# Altium project roverDriveBrushless.PrjPcb
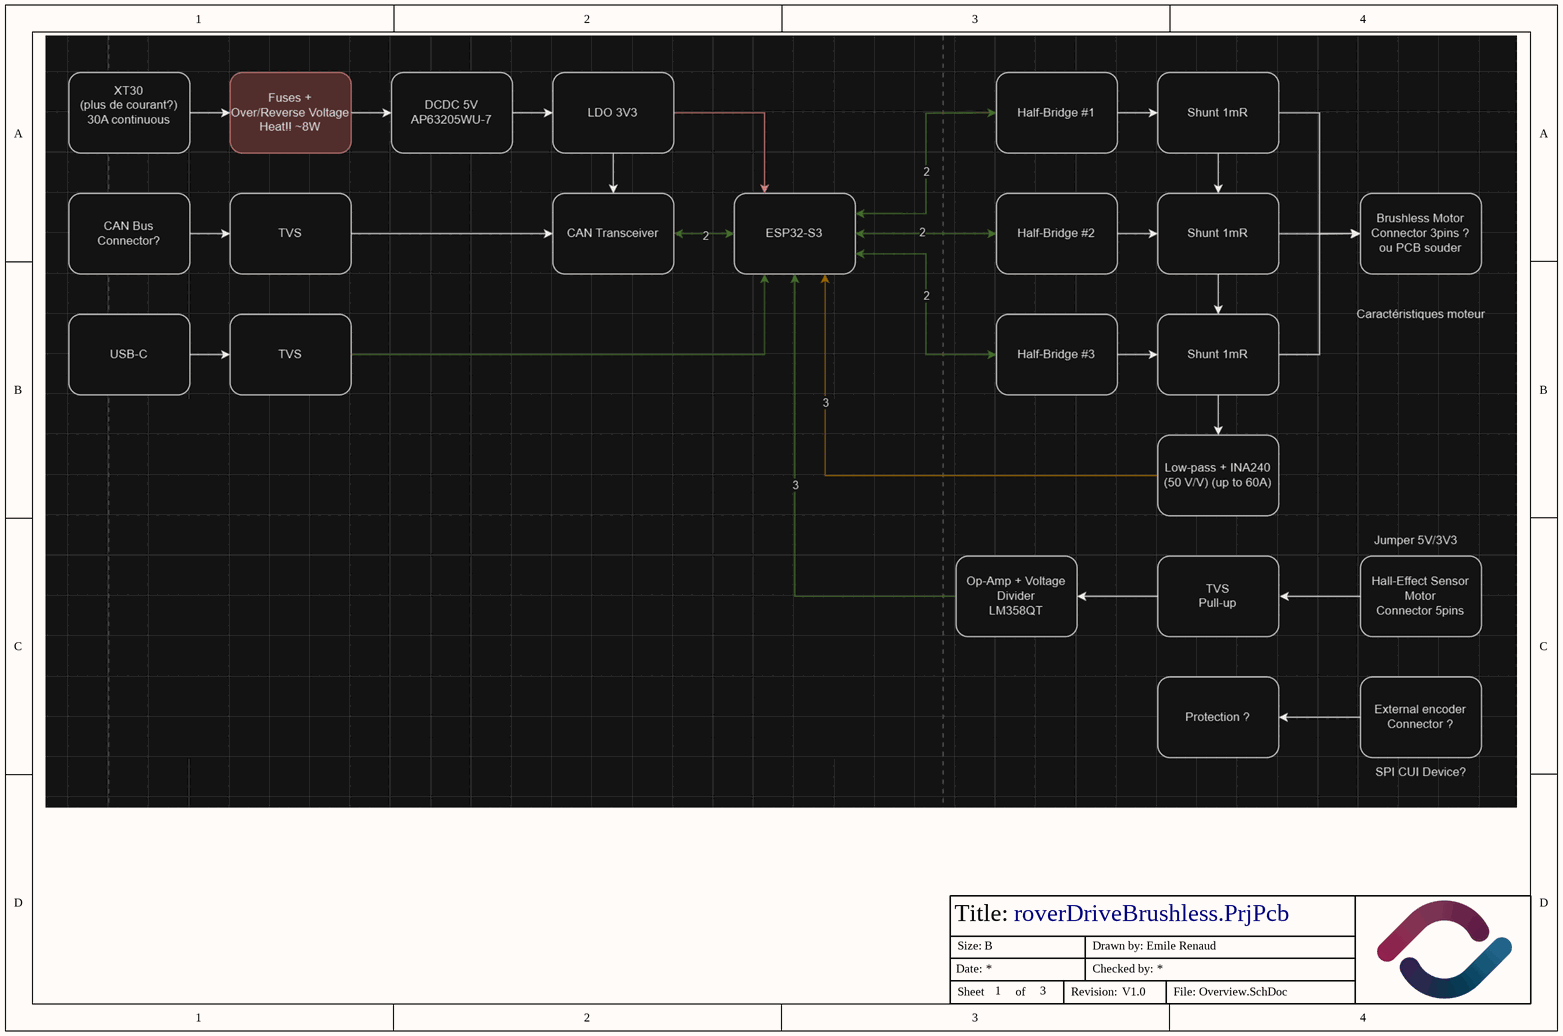
[diagram p0: Overview.SchDoc]
5 sheets, 128 parts. Net scope: global (net labels, ports and power ports of the same name join across sheets).
Board file: roverDriveBrushless.PcbDoc
Sheets:
  Overview.SchDoc
  ESP32.SchDoc
  Power.SchDoc
  MotorDriver.SchDoc
  Sensors.SchDoc

## Sheet Overview.SchDoc
size A4; DrawnBy: Emile Renaud; Revision: V1.0; SheetNumber: 1; SheetTotal: 3

### Notes on the sheet
- Title:
- Date:
- Size:
- B
- Drawn by:
- Checked by:
- Sheet
- of
- Revision:
- File:

## Sheet ESP32.SchDoc
size A4; DrawnBy: Emile Renaud; Revision: V1.0; SheetNumber: 2; SheetTotal: 5
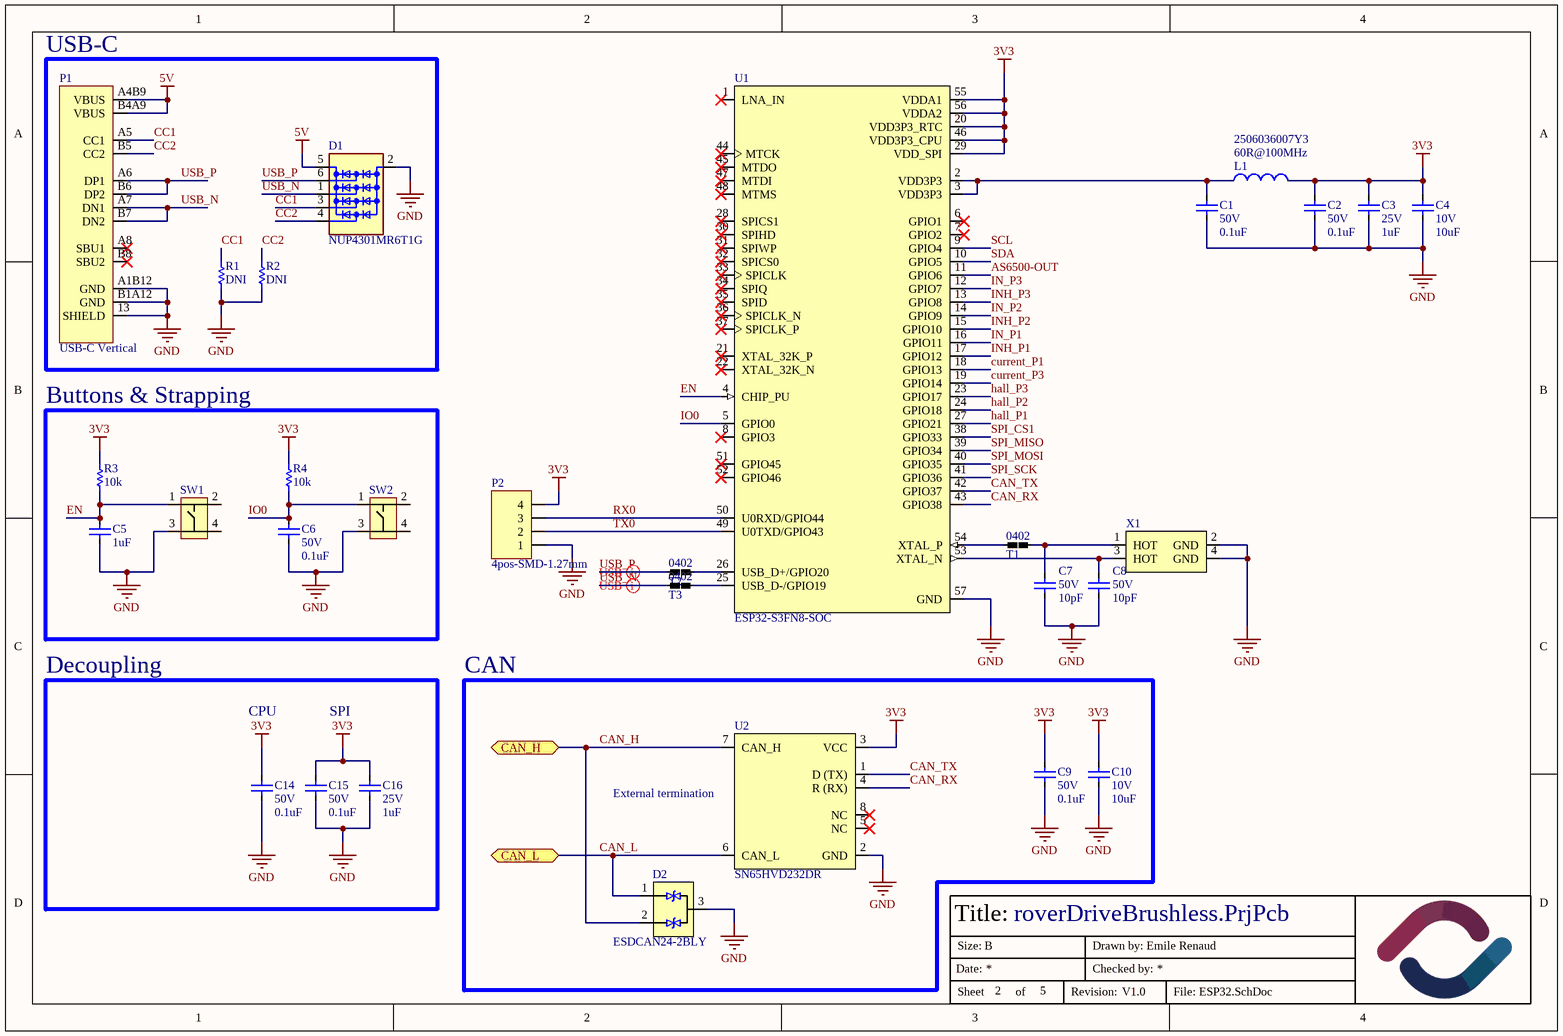
[diagram p1: ESP32.SchDoc]

### Parts
C1  value 0.1uF  Volt: 50V  [CAPACITOR-0603]  (hidden comment: Capacitor-0603-0.1uF-50V-X7R)
C2  value 0.1uF  Volt: 50V  [CAPACITOR-0603]  (hidden comment: Capacitor-0603-0.1uF-50V-X7R)
C3  value 1uF  Volt: 25V  [CAPACITOR-0603]  (hidden comment: Capacitor-0603-1uF-25V-X5R)
C4  value 10uF  Volt: 10V  [CAPACITOR-0603]  (hidden comment: Capacitor-0603-10uF-10V-X5R)
C5  value 1uF  [CAPACITOR-0603]  (hidden comment: Capacitor-0603-1uF-25V-X5R)
C6  value 0.1uF  Volt: 50V  [CAPACITOR-0603]  (hidden comment: Capacitor-0603-0.1uF-50V-X7R)
C7  value 10pF  Volt: 50V  [CAPACITOR-0402]  (hidden comment: Capacitor-0402-10pF-50V-C0G)
C8  value 10pF  Volt: 50V  [CAPACITOR-0402]  (hidden comment: Capacitor-0402-10pF-50V-C0G)
C9  value 0.1uF  Volt: 50V  [CAPACITOR-0603]  (hidden comment: Capacitor-0603-0.1uF-50V-X7R)
C10  value 10uF  Volt: 10V  [CAPACITOR-0603]  (hidden comment: Capacitor-0603-10uF-10V-X5R)
C14  value 0.1uF  Volt: 50V  [CAPACITOR-0603]  (hidden comment: Capacitor-0603-0.1uF-50V-X7R)
C15  value 0.1uF  Volt: 50V  [CAPACITOR-0603]  (hidden comment: Capacitor-0603-0.1uF-50V-X7R)
C16  value 1uF  Volt: 25V  [CAPACITOR-0603]  (hidden comment: Capacitor-0603-1uF-25V-X5R)
D1  NUP4301MR6T1G  [SOT-23-6]
D2  ESDCAN24-2BLY  [SOT-23-3]
L1  2506036007Y3  value 60R@100MHz  [CAPACITOR-0603]
P1  USB-C Vertical  [GCT_USB4145-03-0230-C_REVA2]
P2  4pos-SMD-1.27mm  [HDR1X4-SMD-50mils]
R1  value DNI  [RESISTOR-0603]  (hidden comment: Resistor-0603-5.1k)
R2  value DNI  [RESISTOR-0603]  (hidden comment: Resistor-0603-5.1k)
R3  value 10k  [Resistor-0603]  (hidden comment: SMT resistor)
R4  value 10k  [Resistor-0603]  (hidden comment: SMT resistor)
SW1  PTS815 SJM 250 SMTR LFS  [SW4_PTS815 SJM 250 SMTR LFS_CNK]  (value not drawn)
SW2  PTS815 SJM 250 SMTR LFS  [SW4_PTS815 SJM 250 SMTR LFS_CNK]  (value not drawn)
T1  NetTie_0402  [NetTie-0402]  (value not drawn)
T2  NetTie_0402  [NetTie-0402]  (value not drawn)
T3  NetTie_0402  [NetTie-0402]  (value not drawn)
U1  ESP32-S3FN8-SOC  [VFQFN-56 Exposed Pad]
U2  SN65HVD232DR  [SOIC-8]
X1  CX2016DB40000D0FLJCC  [4-SMD]  (value not drawn)

### Blocks framed on the sheet
USB-C: D1 P1 R1 R2
Buttons & Strapping: C5 C6 R3 R4 SW1 SW2
Decoupling: C14-C16
CAN: C9 C10 D2 U2

### Ports
CAN_H (bidir, see Power[1D]), CAN_L (bidir, see Power[1D])

### Nets
3V3: C2.2 C3.2 C4.2 C9.2 C10.2 C14.2 C15.2 C16.2 L1.2 P2.4 R3.2 R4.2 U1.20(VDD3P3_RTC) U1.29(VDD_SPI) U1.46(VDD3P3_CPU) U1.55(VDDA1) U1.56(VDDA2) U2.3(VCC)
5V: D1.5(VDD) P1.A4B9(VBUS) P1.B4A9(VBUS)
GND: C1.1 C2.1 C3.1 C4.1 C5.1 C6.1 C7.1 C8.1 C9.1 C10.1 C14.1 C15.1 C16.1 D1.2(GND) D2.3(L3) P1.13(SHIELD) P1.A1B12(GND) P1.B1A12(GND) P2.1 R1.1 R2.1 SW1.3 SW2.3 U1.57(GND) U2.2(GND) X1.2(GND) X1.4(GND)
AS6500-OUT: U1.11(GPIO6)
CAN_H: D2.2(GND) U2.7(CAN_H) ; port CAN_H
CAN_L: D2.1(L2) U2.6(CAN_L) ; port CAN_L
CAN_RX: U1.43(GPIO38) U2.4(R_(RX))
CAN_TX: U1.42(GPIO37) U2.1(D_(TX))
CC1: D1.3(L3) P1.A5(CC1) R1.2
CC2: D1.4(L4) P1.B5(CC2) R2.2
current_P1: U1.18(GPIO13)
current_P3: U1.19(GPIO14)
EN: C5.2 R3.1 SW1.1 U1.4(CHIP_PU)
hall_P1: U1.27(GPIO21)
hall_P2: U1.24(GPIO18)
hall_P3: U1.23(GPIO17)
IN_P1: U1.16(GPIO11)
IN_P2: U1.14(GPIO9)
IN_P3: U1.12(GPIO7)
INH_P1: U1.17(GPIO12)
INH_P2: U1.15(GPIO10)
INH_P3: U1.13(GPIO8)
IO0: C6.2 R4.1 SW2.1 U1.5(GPIO0)
RX0: P2.3 U1.50(U0RXD/GPIO44)
SCL: U1.9(GPIO4)
SDA: U1.10(GPIO5)
SPI_CS1: U1.38(GPIO33)
SPI_MISO: U1.39(GPIO34)
SPI_MOSI: U1.40(GPIO35)
SPI_SCK: U1.41(GPIO36)
TX0: P2.2 U1.49(U0TXD/GPIO43)
USB_N: D1.1(L2) P1.A7(DN1) P1.B7(DN2) T3.2
USB_P: D1.6(L1) P1.A6(DP1) P1.B6(DP2) T2.2
NetC1_2: C1.2 L1.1 U1.2(VDD3P3) U1.3(VDD3P3)
NetC7_2: C7.2 T1.1 X1.1(HOT)
NetC8_2: C8.2 U1.53(XTAL_N) X1.3(HOT)
NetT1_2: T1.2 U1.54(XTAL_P)
NetT2_1: T2.1 U1.26(USB_D+/GPIO20)
NetT3_1: T3.1 U1.25(USB_D-/GPIO19)

Not connected (* = marked no-connect by the designer): P1 A8(SBU1)* B8(SBU2)*; SW1 2 4; SW2 2 4; U1 1(LNA_IN)* 6(GPIO1)* 7(GPIO2)* 8(GPIO3)* 21(XTAL_32K_P)* 22(XTAL_32K_N)* 28(SPICS1)* 30(SPIHD)* 31(SPIWP)* 32(SPICS0)* 33(SPICLK)* 34(SPIQ)* 35(SPID)* 36(SPICLK_N)* 37(SPICLK_P)* 44(MTCK)* 45(MTDO)* 47(MTDI)* 48(MTMS)* 51(GPIO45)* 52(GPIO46)*; U2 5(NC)* 8(NC)*

### Layout directives
differential pair; differential pair class USB: USB_N, USB_P

### Notes on the sheet
- CPU
- SPI
- (near U2) External termination
- Title:
- Date:
- Size:
- B
- Drawn by:
- Checked by:
- Sheet
- of
- Revision:
- File:
- (in symbol NetTie_0402) 0402

### Library data of the parts
C1 C2 C6 C9 C14 C15 = Capacitor-0603-0.1uF-50V-X7R: Precision: X7R-10%; Package / Case: Metric 1608, EIA 0603; Mounted: Yes; Supplier 1: Digi-Key; Supplier Part Number 1: 1276-1935-2-ND; Supplier 2: Digi-Key; Supplier Part Number 2: 1276-1934-2-ND
C3 C16 = Capacitor-0603-1uF-25V-X5R: Precision: X5R-10%; Package / Case: Metric 1608, EIA 0603; Mounted: Yes; Supplier 1: Digi-Key; Supplier Part Number 1: 1276-1859-2-ND; Supplier 2: Digi-Key; Supplier Part Number 2: 1276-1942-2-ND
C4 C10 = Capacitor-0603-10uF-10V-X5R: 10 µF ±20% 10V Ceramic Capacitor X5R 0603 (1608 Metric); Supplier 1: Digikey; Supplier Part Number 1: 4713-GMC10X5R106M10NTCT-ND; Mounted: Yes; Package / Case: Metric 1608 , EIA 0603; Precision: 20%
C5 = Capacitor-0603-1uF-25V-X5R: Precision: X5R-10%; Volt: 25V; Package / Case: Metric 1608, EIA 0603; Mounted: Yes; Supplier 1: Digi-Key; Supplier Part Number 1: 1276-1859-2-ND; Supplier 2: Digi-Key; Supplier Part Number 2: 1276-1942-2-ND
C7 C8 = Capacitor-0402-10pF-50V-C0G: Precision: C0G - 10%; Package / Case: 0402 (1005 Metric); Mounted: Yes; Supplier 1: Digi-Key; Supplier Part Number 1: 399-C0402C100K5GAC7867CT-ND; Supplier 2: Digi-Key; HelpURL: https://connect.kemet.com:7667/gateway/IntelliData-ComponentDocumentation/1.0/download/datasheet/C0402C100K5GACTU
D1 = NUP4301MR6T1G: 4CH Clamp Ipp Tvs Diode Surface Mount SOT23-6 (SC74); Volt: 70; Supplier 1: Digi-Key; Supplier Part Number 1: NUP4301MR6T1GOSTR-ND; Mounted: Yes; Package / Case: SOT23-6
D2 = ESDCAN24-2BLY: 55V Clamp 6A (8/20µs) Ipp Tvs Diode Surface Mount SOT-23; Volt: 24; Supplier 1: Digi-Key; Supplier Part Number 1: 5272-ESDCAN24-2BLYCT-ND; Mounted: Yes; Package / Case: SOT-23-3
L1 = 2506036007Y3: 60 Ohms @ 100 MHz 1 Signal Line Ferrite Bead 0603 (1608 Metric) 3A 40mOhm; Supplier 1: Digi-Key; Mounted: Yes; Supplier Part Number 1: 1934-1396-1-ND; Package / Case: SMD; Current: 3A
P1 = USB-C Vertical: USB4145-03-0230-C / 5A USB USB 2.0 Receptacle; Supplier 1: Digikey; Supplier Part Number 1: 2073-USB4145-03-0230-CCT-ND; Mounted: Yes; Package / Case: SMD; Volt: N/A
P2 = 4pos-SMD-1.27mm: 4pos SMD 1.27mm; Supplier 1: Digi-Key; Supplier Part Number 1: N/A; Mounted: Yes; Package / Case: TH; Volt: N/A
R1 R2 = Resistor-0603-DNI: 0603 footprint DO NOT INSTALL; Mounted: Yes; Package/Case: Metric 1608 , EIA 0603
R3 R4 = Resistor0603-10k: Precision: 1%; Watt: 0.1W; Mounted: Yes; Package / Case: Metric 1608, EIA 0603; Supplier 2: Digi-Key; Supplier 4: Digi-Key; Supplier Part Number 2: RMCF0603FT10K0TR-ND; Supplier 1: Digi-Key; Supplier 3: Digi-Key; Supplier Part Number 1: 311-10.0KHRTR-ND
SW1 SW2 = PTS815 SJM 250 SMTR LFS: TACT 4.2 X 3.2, 2.5 MM H, 180GF,; Volt: 12V; Current: 0.05A; Supplier 1: Digi-Key; Supplier Part Number 1: CKN12215-1-ND; Mounted: Yes
U1 = ESP32-S3FN8-SOC: IC RF TxRx + MCU Bluetooth, WiFi 802.11b/g/n, Bluetooth v5.0 2.412GHz ~ 2.484GHz 56-VFQFN Exposed Pad; MF: Espressif Systems; Availability: In Stock; MP: ESP32-S3FN8; Package: 56-VFQFN Exposed Pad; DigiKey Link: https://www.digikey.ca/en/products/detail/espressif-systems/ESP32-S3FN8/15822446; HelpURL: https://www.espressif.com/sites/default/files/documentation/esp32-s3_datasheet_en.pdf; Supplier 1: Digikey; Supplier Part Number 1: 1965-ESP32-S3FN8-ND
U2 = SN65HVD232DR: 1/1 Transceiver Half CANbus 8-SOIC; Package / Case: 8-SOIC; Mounted: Yes; Supplier 1: Digikey; Supplier Part Number 1: 296-26344-1-ND; HelpURL: https://www.ti.com/lit/ds/symlink/sn65hvd230.pdf?HQS=dis-dk-null-digikeymode-dsf-pf-null-wwe&ts=1723930967656&ref_url=https%253A%252F%252Fwww.ti.com%252Fgeneral%252Fdocs%252Fsuppproductinfo.tsp%253FdistId%253D10%2526gotoUrl%253Dhttps%253A%252F%252Fwww.ti.com%252Flit%252Fgpn%252Fsn65hvd230
X1 = CX2016DB40000D0FLJCC: 40 MHz ±10ppm Crystal 8pF 50 Ohms 4-SMD, No Lead; Supplier 1: Digikey; Supplier Part Number 1: 478-CX2016DB40000D0FLJCCCT-ND; Parameter 1: *

## Sheet Power.SchDoc
size A4; DrawnBy: Emile Renaud; Revision: V1.0; SheetNumber: 3; SheetTotal: 5
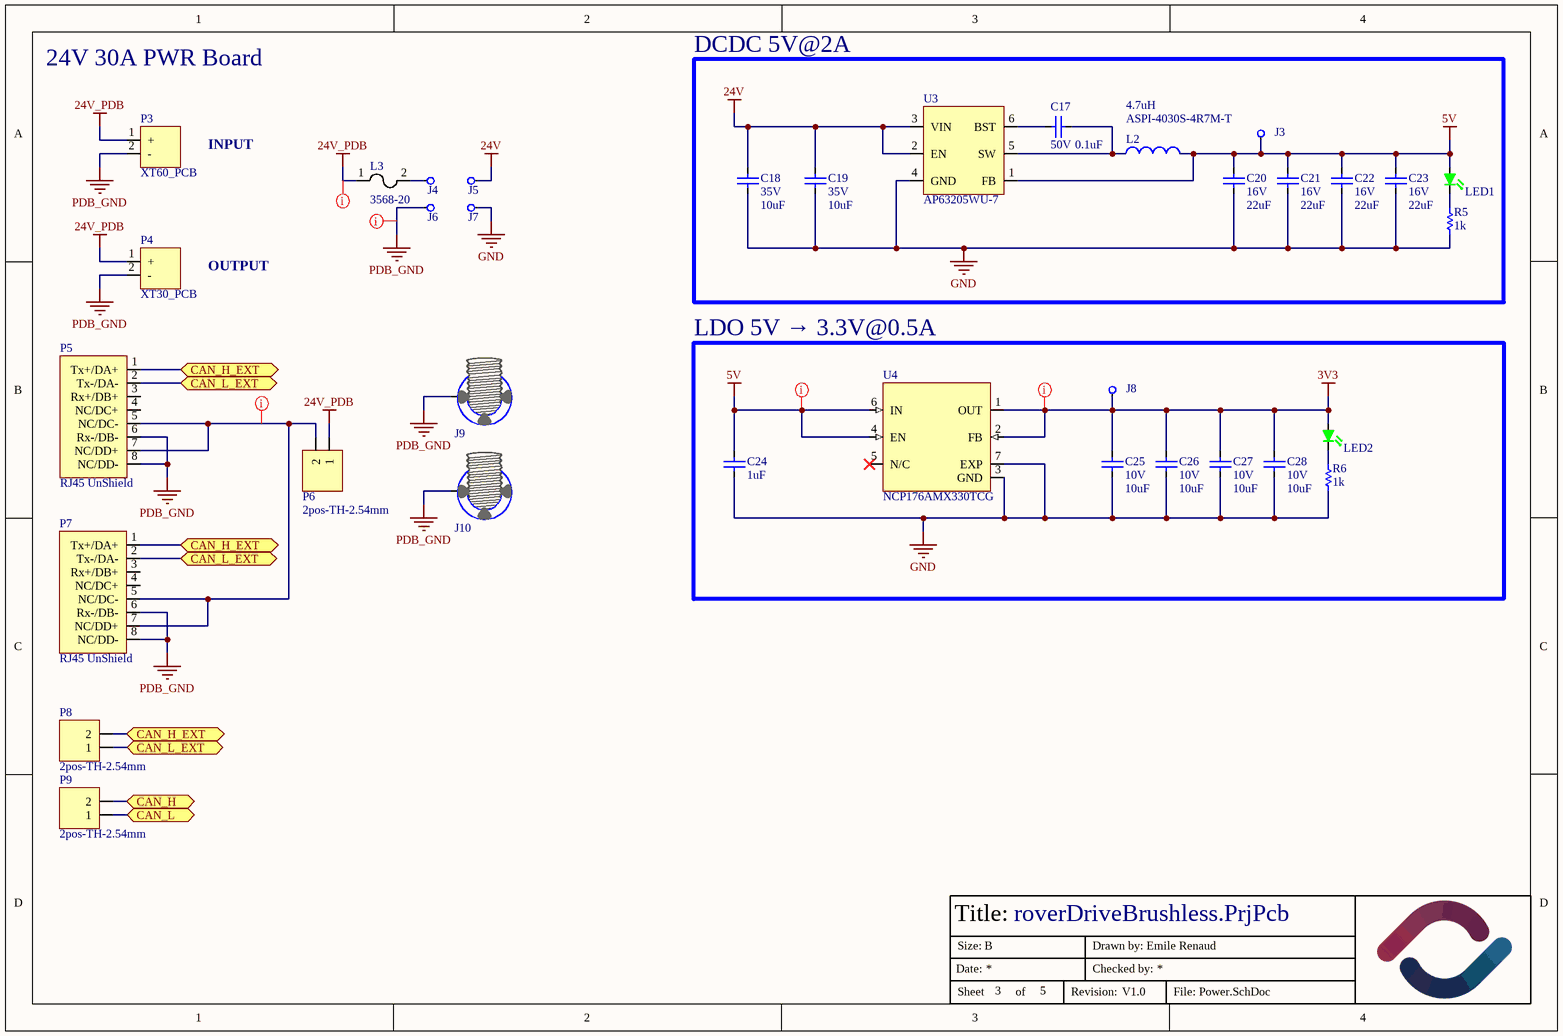
[diagram p2: Power.SchDoc]

### Parts
C17  value 0.1uF  Volt: 50V  [CAPACITOR-0603]  (hidden comment: Capacitor-0603-0.1uF-50V-X7R)
C18  value 10uF  Volt: 35V  [CAPACITOR-0805]  (hidden comment: Capacitor-0805-10uF-35V-X5R)
C19  value 10uF  Volt: 35V  [CAPACITOR-0805]  (hidden comment: Capacitor-0805-10uF-35V-X5R)
C20  value 22uF  Volt: 16V  [CAPACITOR-0805]  (hidden comment: Capacitor-0805-22uF-16V-X5R)
C21  value 22uF  Volt: 16V  [CAPACITOR-0805]  (hidden comment: Capacitor-0805-22uF-16V-X5R)
C22  value 22uF  Volt: 16V  [CAPACITOR-0805]  (hidden comment: Capacitor-0805-22uF-16V-X5R)
C23  value 22uF  Volt: 16V  [CAPACITOR-0805]  (hidden comment: Capacitor-0805-22uF-16V-X5R)
C24  value 1uF  [CAPACITOR-0603]  (hidden comment: Capacitor-0603-1uF-25V-X5R)
C25  value 10uF  Volt: 10V  [CAPACITOR-0603]  (hidden comment: Capacitor-0603-10uF-10V-X5R)
C26  value 10uF  Volt: 10V  [CAPACITOR-0603]  (hidden comment: Capacitor-0603-10uF-10V-X5R)
C27  value 10uF  Volt: 10V  [CAPACITOR-0603]  (hidden comment: Capacitor-0603-10uF-10V-X5R)
C28  value 10uF  Volt: 10V  [CAPACITOR-0603]  (hidden comment: Capacitor-0603-10uF-10V-X5R)
J3  hole  [PAD-1.2MM-silk]  (value not drawn)  (no BOM)
J4  hole  [HOLE-2.70MM]  (value not drawn)  (no BOM)
J5  hole  [HOLE-2.70MM]  (value not drawn)  (no BOM)
J6  hole  [HOLE-2.70MM]  (value not drawn)  (no BOM)
J7  hole  [HOLE-2.70MM]  (value not drawn)  (no BOM)
J8  hole  [PAD-1.2MM-silk]  (value not drawn)  (no BOM)
J9  hole  [HOLE-3.40MM-M3-7MMEYELET-MountingFeature]  (value not drawn)  (no BOM)
J10  hole  [HOLE-3.40MM-M3-7MMEYELET-MountingFeature]  (value not drawn)  (no BOM)
L2  ASPI-4030S-4R7M-T  value 4.7uH  [INDUCTOR_ASPI-4030S-100M]
L3  3568-20  [FUSE_3568-20]
LED1  3147-B1911NG--20D000214U1930CT-ND  [LED-0603-2PIN-SILKSCREEN]  (value not drawn)
LED2  3147-B1911NG--20D000214U1930CT-ND  [LED-0603-2PIN-SILKSCREEN]  (value not drawn)
P3  XT60_PCB  [XT60PW-M]
P4  XT30_PCB  [XT30PW_smd]
P5  RJ45 UnShield  [AMPHENOL_54602-908LF]
P6  2pos-TH-2.54mm  [HDR1X2]
P7  RJ45 UnShield  [AMPHENOL_54602-908LF]
P8  2pos-TH-2.54mm  [HDR1X2]
P9  2pos-TH-2.54mm  [HDR1X2]
R5  value 1k  [Resistor-0603]  (hidden comment: SMT resistor)
R6  value 1k  [Resistor-0603]  (hidden comment: SMT resistor)
U3  AP63205WU-7  [SOT-23-6]
U4  NCP176AMX330TCG  [XFDFN-6 Exposed Pad]

### Blocks framed on the sheet
DCDC 5V@2A: C17-C23 J3 L2 LED1 R5 U3
LDO 5V → 3.3V@0.5A: C24-C28 J8 LED2 R6 U4

### Ports
CAN_H (bidir, see ESP32[2C]), CAN_H_EXT (bidir, see Power[1B], Power[1C]), CAN_H_EXT (bidir, see Power[1C]), CAN_L (bidir, see ESP32[2D]), CAN_L_EXT (bidir, see Power[1B], Power[1C]), CAN_L_EXT (bidir, see Power[1C])

### Nets
3V3: C25.2 C26.2 C27.2 C28.2 J8.1 LED2.2(R) U4.1(OUT) U4.2(FB)
5V: C20.2 C21.2 C22.2 C23.2 C24.2 J3.1 L2.2 LED1.2(R) U3.1(FB) U4.4(EN) U4.6(IN)
24V: C18.2 C19.2 J5.1 U3.2(EN) U3.3(VIN)
24V_PDB: L3.1 P3.1(+) P4.1(+) P6.1
GND: C18.1 C19.1 C20.1 C21.1 C22.1 C23.1 C24.1 C25.1 C26.1 C27.1 C28.1 J7.1 R5.1 R6.1 U3.4(GND) U4.3(GND) U4.7(EXP)
PDB_GND: J6.1 J9.1 J10.1 P3.2(-) P4.2(-) P5.6(Rx-/DB-) P5.8(NC/DD-) P7.6(Rx-/DB-) P7.8(NC/DD-)
CAN_H: P9.2 ; port CAN_H
CAN_H_EXT: P5.1(Tx+/DA+) P7.1(Tx+/DA+) P8.2 ; port CAN_H_EXT
CAN_L: P9.1 ; port CAN_L
CAN_L_EXT: P5.2(Tx-/DA-) P7.2(Tx-/DA-) P8.1 ; port CAN_L_EXT
NetC17_1: C17.1 U3.6(BST)
NetC17_2: C17.2 L2.1 U3.5(SW)
NetJ4_1: J4.1 L3.2
NetLED1_1: LED1.1(K) R5.2
NetLED2_1: LED2.1(K) R6.2
NetP5_5: P5.5(NC/DC-) P5.7(NC/DD+) P6.2 P7.5(NC/DC-) P7.7(NC/DD+)

Not connected (* = marked no-connect by the designer): P5 3(Rx+/DB+) 4(NC/DC+); P7 3(Rx+/DB+) 4(NC/DC+); U4 5(N/C)*

### Layout directives
net class LOW_POWER: 3V3, 5V
net class Power: 24V_PDB, NetP5_5, PDB_GND

### Notes on the sheet
- 24V 30A PWR Board
- INPUT
- OUTPUT
- Title:
- Date:
- Size:
- B
- Drawn by:
- Checked by:
- Sheet
- of
- Revision:
- File:

### Library data of the parts
C17 = Capacitor-0603-0.1uF-50V-X7R: Precision: X7R-10%; Package / Case: Metric 1608, EIA 0603; Mounted: Yes; Supplier 1: Digi-Key; Supplier Part Number 1: 1276-1935-2-ND; Supplier 2: Digi-Key; Supplier Part Number 2: 1276-1934-2-ND
C18 C19 = Capacitor-0805-10uF-35V-X5R: Precision: X5R-10%; Package / Case: Metric 2012 , EIA 0805; Mounted: Yes; Supplier 1: Digi-Key; Supplier Part Number 1: 490-10515-1-ND; Supplier 2: Digi-Key
C20-C23 = Capacitor-0805-22uF-16V-X5R: Precision: X5R-10%; Package / Case: Metric 2012 , EIA 0805; Mounted: Yes; Supplier 1: Digi-Key; Supplier Part Number 1: 1276-6780-1-ND; Supplier 2: Digi-Key
C24 = Capacitor-0603-1uF-25V-X5R: Precision: X5R-10%; Volt: 25V; Package / Case: Metric 1608, EIA 0603; Mounted: Yes; Supplier 1: Digi-Key; Supplier Part Number 1: 1276-1859-2-ND; Supplier 2: Digi-Key; Supplier Part Number 2: 1276-1942-2-ND
C25-C28 = Capacitor-0603-10uF-10V-X5R: as C4 on sheet ESP32; Supplier 1: Digikey; Supplier Part Number 1: 4713-GMC10X5R106M10NTCT-ND; Mounted: Yes; Package / Case: Metric 1608 , EIA 0603; Precision: 20%
J3 J8 = PAD 1.2mm: Mounted: N/A
J4-J7 = Hole 2.70mm AWG12-Stranded: Hole for 12 AWG Stranded Wire; Mounted: N/A
J9 J10 = Hole 3.40mm M3-MountingFeature: Hole for M3 Bolt with 7mm pad; Mounted: N/A
L2 = ASPI-4030S-4R7M-T: 4.7 µH Shielded Drum Core, Wirewound Inductor 2 A 60mOhm Nonstandard; Current: 2A; Precision: 20%; Supplier 1: Digi-Key; Mounted: Yes; Supplier Part Number 1: 535-12322-1-ND; Package / Case: SMD; HelpURL: https://abracon.com/Magnetics/power/ASPI-4030S.pdf
L3 = 3568-20: Fuse Holder 30 A 500V 1 Circuit Blade Through Hole; Current: 30A; Supplier 1: Digi-Key; Mounted: Yes; Supplier Part Number 1: 36-3568-20-ND; Package / Case: TH
LED1 LED2 = LED_GREEN: LED GREEN DIFFUSED 0603 SMD; Package / Case: 0603 (1608 Metric); Mounted: Yes; Supplier 1: Digi-Key; Supplier Part Number 1: 3147-B1911NG--20D000214U1930CT-ND
P3 = XT60_pcb: XT60; Supplier 1: Digi-Key; Supplier Part Number 1: N/A277-1667-ND; Mounted: Yes; Package / Case: TH; Volt: N/A
P4 = XT30_pcb: XT30; Supplier 1: Digi-Key; Mounted: Yes; Package / Case: TH; Volt: N/A
P5 P7 = RJ545: Jack Modular Connector 8p8c (RJ45, Ethernet) 90° Angle (Right) Unshielded Cat3; Supplier 1: Digikey; Supplier Part Number 1: 609-1046-ND; Mounted: Yes; Package / Case: SMD; Volt: N/A; HelpURL: https://cdn.amphenol-cs.com/media/wysiwyg/files/drawing/c-bmj-0102.pdf
P6 P8 P9 = 2pos-TH-2.54mm: 2pos TH 2.54mm Header; Supplier 1: Digi-Key; Supplier Part Number 1: N/A; Mounted: Yes; Package / Case: TH; Volt: N/A
R5 R6 = Resistor0603-1k: Precision: 1%; Watt: 0.1W; Mounted: Yes; Package / Case: Metric 1608, EIA 0603; Supplier 2: Digi-Key; Supplier 4: Digi-Key; Supplier Part Number 2: 311-1.00KHRTR-ND; Supplier 1: Digi-Key; Supplier 3: Digi-Key; Supplier Part Number 1: RMCF0603FT1K00TR-ND; Supplier Part Number 3: AG1307TR-ND
U3 = AP63205WU-7: Fixed 5V@2A. 32V Input. SOT-23-6; Grade: None; Input Max Voltage: 36V; Supplier 1: Digi-Key; Supplier Part Number 1: AP63205WU-7DICT-ND; HelpURL: https://www.diodes.com/assets/Datasheets/AP63200-AP63201-AP63203-AP63205.pdf; Package / Case: SOT-23-6; Mounted: Yes
U4 = NCP176AMX330TCG: IC REG LINEAR 3.3V 500mA 6-XDFN; Supplier 1: Digi-Key; Supplier Part Number 1: NCP176AMX330TCGOSCT-ND; Package / Case: 6-XDFN; Mounted: Yes; HelpURL: https://www.onsemi.com/pdf/datasheet/ncp176-d.pdf

## Sheet MotorDriver.SchDoc
size A4; DrawnBy: Emile Renaud; Revision: V1.0; SheetNumber: 4; SheetTotal: 5
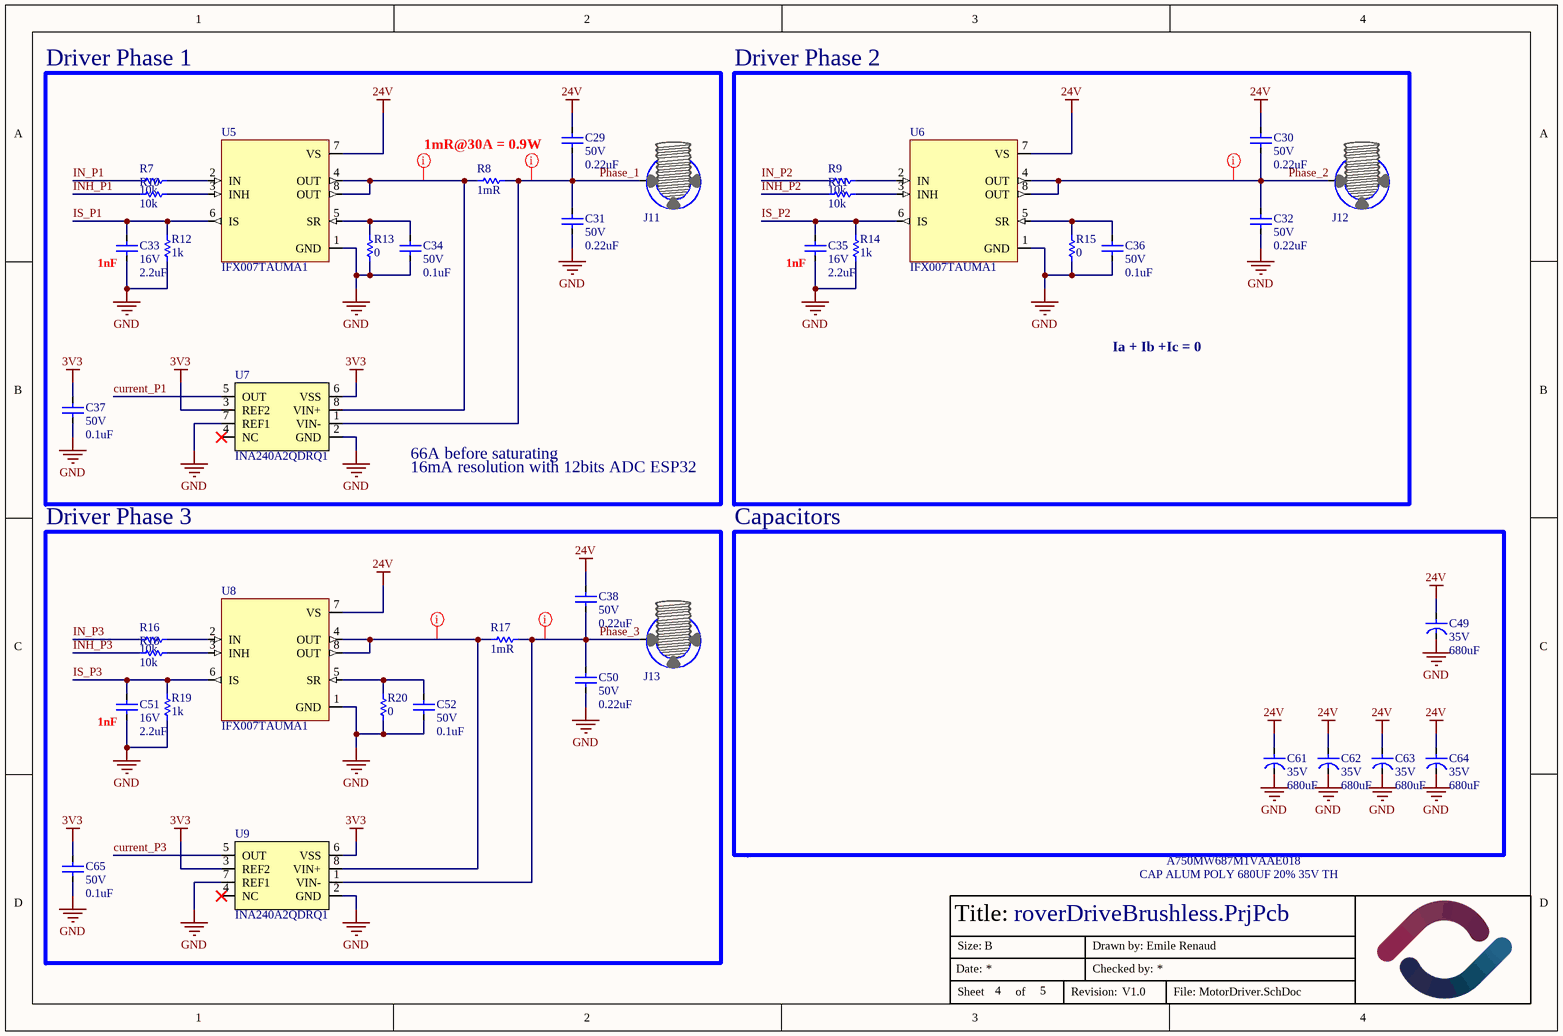
[diagram p3: MotorDriver.SchDoc]

### Parts
C29  value 0.22uF  Volt: 50V  [CAPACITOR-0603]  (hidden comment: Capacitor-0603-0.22uF-50V-X7R)
C30  value 0.22uF  Volt: 50V  [CAPACITOR-0603]  (hidden comment: Capacitor-0603-0.22uF-50V-X7R)
C31  value 0.22uF  Volt: 50V  [CAPACITOR-0603]  (hidden comment: Capacitor-0603-0.22uF-50V-X7R)
C32  value 0.22uF  Volt: 50V  [CAPACITOR-0603]  (hidden comment: Capacitor-0603-0.22uF-50V-X7R)
C33  value 2.2uF  Volt: 16V  [CAPACITOR-0603]  (hidden comment: Capacitor-0603-2.2uF-16V-X5R)
C34  value 0.1uF  Volt: 50V  [CAPACITOR-0603]  (hidden comment: Capacitor-0603-0.1uF-50V-X7R)
C35  value 2.2uF  Volt: 16V  [CAPACITOR-0603]  (hidden comment: Capacitor-0603-2.2uF-16V-X5R)
C36  value 0.1uF  Volt: 50V  [CAPACITOR-0603]  (hidden comment: Capacitor-0603-0.1uF-50V-X7R)
C37  value 0.1uF  Volt: 50V  [CAPACITOR-0603]  (hidden comment: Capacitor-0603-0.1uF-50V-X7R)
C38  value 0.22uF  Volt: 50V  [CAPACITOR-0603]  (hidden comment: Capacitor-0603-0.22uF-50V-X7R)
C49  value 680uF  Volt: 35V  [CAPACITOR-Aluminium-10.0x16mm-5mmPitch]  (hidden comment: CAP ALUM 680UF 20% 35V TH ESR 18mR)
C50  value 0.22uF  Volt: 50V  [CAPACITOR-0603]  (hidden comment: Capacitor-0603-0.22uF-50V-X7R)
C51  value 2.2uF  Volt: 16V  [CAPACITOR-0603]  (hidden comment: Capacitor-0603-2.2uF-16V-X5R)
C52  value 0.1uF  Volt: 50V  [CAPACITOR-0603]  (hidden comment: Capacitor-0603-0.1uF-50V-X7R)
C61  value 680uF  Volt: 35V  [CAPACITOR-Aluminium-10.0x16mm-5mmPitch]  (hidden comment: CAP ALUM 680UF 20% 35V TH ESR 18mR)
C62  value 680uF  Volt: 35V  [CAPACITOR-Aluminium-10.0x16mm-5mmPitch]  (hidden comment: CAP ALUM 680UF 20% 35V TH ESR 18mR)
C63  value 680uF  Volt: 35V  [CAPACITOR-Aluminium-10.0x16mm-5mmPitch]  (hidden comment: CAP ALUM 680UF 20% 35V TH ESR 18mR)
C64  value 680uF  Volt: 35V  [CAPACITOR-Aluminium-10.0x16mm-5mmPitch]  (hidden comment: CAP ALUM 680UF 20% 35V TH ESR 18mR)
C65  value 0.1uF  Volt: 50V  [CAPACITOR-0603]  (hidden comment: Capacitor-0603-0.1uF-50V-X7R)
J11  hole  [HOLE-M2-Bolt]  (value not drawn)  (no BOM)
J12  hole  [HOLE-M2-Bolt]  (value not drawn)  (no BOM)
J13  hole  [HOLE-M2-Bolt]  (value not drawn)  (no BOM)
R7  value 10k  [Resistor-0603]  (hidden comment: SMT resistor)
R8  value 1mR  [RESISTOR-3920]  (hidden comment: SMT resistor)
R9  value 10k  [Resistor-0603]  (hidden comment: SMT resistor)
R10  value 10k  [Resistor-0603]  (hidden comment: SMT resistor)
R11  value 10k  [Resistor-0603]  (hidden comment: SMT resistor)
R12  value 1k  [Resistor-0603]  (hidden comment: SMT resistor)
R13  value 0  [Resistor-0603]  (hidden comment: SMT resistor)
R14  value 1k  [Resistor-0603]  (hidden comment: SMT resistor)
R15  value 0  [Resistor-0603]  (hidden comment: SMT resistor)
R16  value 10k  [Resistor-0603]  (hidden comment: SMT resistor)
R17  value 1mR  [RESISTOR-3920]  (hidden comment: SMT resistor)
R18  value 10k  [Resistor-0603]  (hidden comment: SMT resistor)
R19  value 1k  [Resistor-0603]  (hidden comment: SMT resistor)
R20  value 0  [Resistor-0603]  (hidden comment: SMT resistor)
U5  IFX007TAUMA1  [DPAK127P1500X440-8N]
U6  IFX007TAUMA1  [DPAK127P1500X440-8N]
U7  INA240A2QDRQ1  [SOIC-8]
U8  IFX007TAUMA1  [DPAK127P1500X440-8N]
U9  INA240A2QDRQ1  [SOIC-8]

### Blocks framed on the sheet
Driver Phase 1: C29 C31 C33 C34 C37 J11 R7 R8 R10 R12 R13 U5 U7
Driver Phase 2: C30 C32 C35 C36 J12 R9 R11 R14 R15 U6
Driver Phase 3: C38 C50-C52 C65 J13 R16-R20 U8 U9
Capacitors: C49 C61-C64

### Nets
3V3: C37.2 C65.2 U7.3(REF2) U7.6(VSS) U9.3(REF2) U9.6(VSS)
24V: C29.2 C30.2 C38.2 C49.1 C61.1 C62.1 C63.1 C64.1 U5.7(VS) U6.7(VS) U8.7(VS)
GND: C31.1 C32.1 C33.1 C34.1 C35.1 C36.1 C37.1 C49.2 C50.1 C51.1 C52.1 C61.2 C62.2 C63.2 C64.2 C65.1 R12.1 R13.1 R14.1 R15.1 R19.1 R20.1 U5.1(GND) U6.1(GND) U7.2(GND) U7.7(REF1) U8.1(GND) U9.2(GND) U9.7(REF1)
current_P1: U7.5(OUT)
current_P3: U9.5(OUT)
IN_P1: R7.1
IN_P2: R9.1
IN_P3: R16.1
INH_P1: R10.1
INH_P2: R11.1
INH_P3: R18.1
IS_P1: C33.2 R12.2 U5.6(IS)
IS_P2: C35.2 R14.2 U6.6(IS)
IS_P3: C51.2 R19.2 U8.6(IS)
Phase_1: C29.1 C31.2 J11.1 R8.2 U7.1(VIN-)
Phase_2: C30.1 C32.2 J12.1 U6.4(OUT) U6.8(OUT)
Phase_3: C38.1 C50.2 J13.1 R17.2 U9.1(VIN-)
NetC34_2: C34.2 R13.2 U5.5(SR)
NetC36_2: C36.2 R15.2 U6.5(SR)
NetC52_2: C52.2 R20.2 U8.5(SR)
NetR7_2: R7.2 U5.2(IN)
NetR8_1: R8.1 U5.4(OUT) U5.8(OUT) U7.8(VIN+)
NetR9_2: R9.2 U6.2(IN)
NetR10_2: R10.2 U5.3(INH)
NetR11_2: R11.2 U6.3(INH)
NetR16_2: R16.2 U8.2(IN)
NetR17_1: R17.1 U8.4(OUT) U8.8(OUT) U9.8(VIN+)
NetR18_2: R18.2 U8.3(INH)

Not connected (* = marked no-connect by the designer): U7 4(NC)*; U9 4(NC)*

### Layout directives
net class Power: NetR8_1, NetR17_1, Phase_1, Phase_2, Phase_3

### Notes on the sheet
- (near R8) 1mR@30A = 0.9W
- (near C33) 1nF
- (near C35) 1nF
- Ia + Ib +Ic = 0
- 66A before saturating
- 16mA resolution with 12bits ADC ESP32
- (near C51) 1nF
- CAP ALUM POLY 680UF 20% 35V TH
- A750MW687M1VAAE018
- Title:
- Date:
- Size:
- B
- Drawn by:
- Checked by:
- Sheet
- of
- Revision:
- File:

### Library data of the parts
C29-C32 C38 C50 = Capacitor-0603-0.22uF-50V-X7R: Precision: X7R-10%; Package / Case: Metric 1608, EIA 0603; Mounted: Yes; Supplier 1: Digi-Key; Supplier Part Number 1: 1276-6600-1-ND; Supplier 2: Digi-Key
C33 C35 C51 = Capacitor-0603-2.2uF-16V-X5R: 2.2 µF ±10% 16V Ceramic Capacitor X5R 0603 (1608 Metric); Precision: X5R-10%; Mounted: Yes; Package / Case: Metric 1608 , EIA 0603; Supplier 1: Digikey; Supplier Part Number 1: 1276-1040-1-ND
C34 C36 C37 C52 C65 = Capacitor-0603-0.1uF-50V-X7R: Precision: X7R-10%; Package / Case: Metric 1608, EIA 0603; Mounted: Yes; Supplier 1: Digi-Key; Supplier Part Number 1: 1276-1935-2-ND; Supplier 2: Digi-Key; Supplier Part Number 2: 1276-1934-2-ND
C49 C61-C64 = Capacitor-680uF-35V-TH: Precision: 20%; Mounted: Yes; Supplier 1: Digi-Key; Supplier Part Number 1: 399-A750MW687M1VAAE018-ND; Supplier 2: Digi-Key; ESR: 18mR
J11-J13 = Hole 2.3mm M2: Hole for M2 Bolt with 4mm pad; Mounted: N/A
R7 R9-R11 R16 R18 = Resistor-0603-10k: Resistor0603-10k; Precision: 1%; Watt: 0.1W; Mounted: Yes; Package / Case: Metric 1608, EIA 0603; Supplier 1: Digi-Key; Supplier Part Number 1: 311-10.0KHRTR-ND
R8 R17 = Resistor-3920-1mR: Precision: 1%; Watt: 8W; Mounted: Yes; Package / Case: 3920; Supplier 1: Digi-Key; Supplier Part Number 1: 4506-PEWM3920D1L00K9CT-ND
R12 R14 R19 = Resistor-0603-1k: Resistor0603-1k; Precision: 1%; Watt: 0.1W; Mounted: Yes; Package / Case: Metric 1608, EIA 0603; Supplier 1: Digi-Key; Supplier Part Number 1: 311-1.00KHRCT-ND
R13 R15 R20 = Resistor-0603-0.0: Resistor0603-0.0; Precision: 1%; Watt: 0.1W; Mounted: Yes; Package / Case: Metric 1608, EIA 0603; Supplier 1: Digi-Key; Supplier Part Number 1: 311-0.0GRCT-ND
U5 U6 U8 = IFX007TAUMA1: Half Bridge Driver DC Motors, General Purpose Power MOSFET PG-TO263-7-1 55A 40V; Supplier 1: Digi-Key; Supplier Part Number 1: IFX007TAUMA1CT-ND; Package / Case: TO-263-8; Mounted: Yes
U7 U9 = INA240: Current Sense Amplifier 1 Circuit 8-SOIC 50 V/V; Supplier 1: Digi-Key; Supplier Part Number 1: 296-49647-1-ND; Package / Case: 8-SOIC; Mounted: Yes; helpURL: https://www.ti.com/general/docs/suppproductinfo.tsp?distId=10&gotoUrl=https%3A%2F%2Fwww.ti.com%2Flit%2Fgpn%2Fina240

## Sheet Sensors.SchDoc
size A4; DrawnBy: Emile Renaud; Revision: V1.0; SheetNumber: 5; SheetTotal: 5
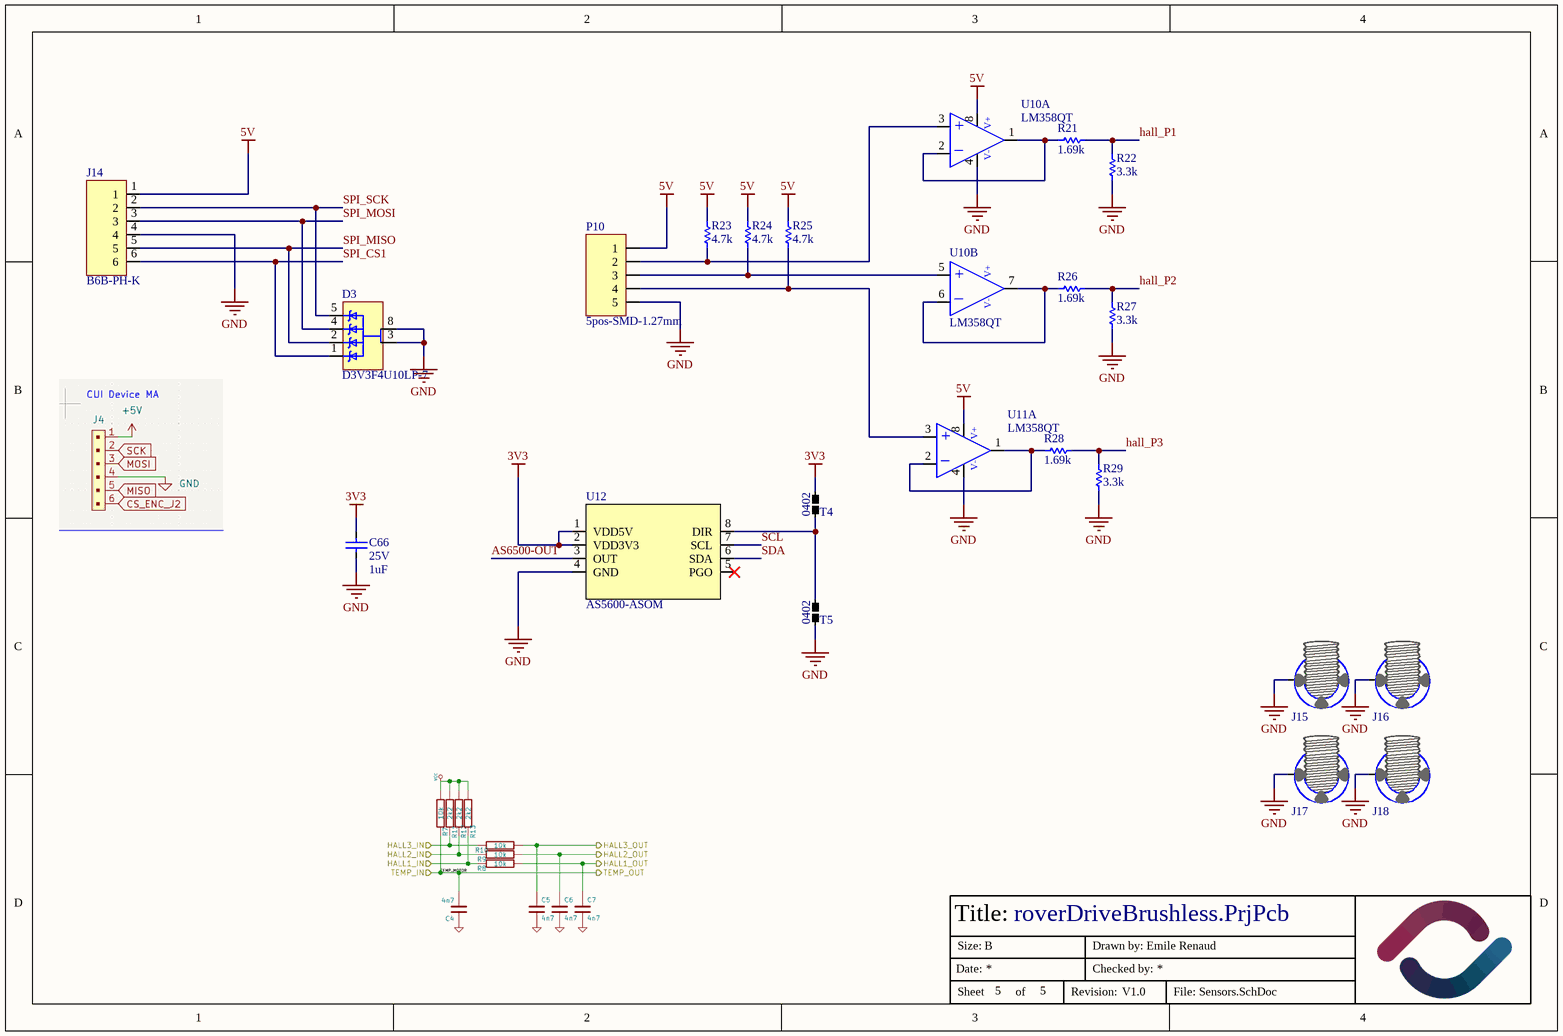
[diagram p4: Sensors.SchDoc]

### Parts
C66  value 1uF  Volt: 25V  [CAPACITOR-0603]  (hidden comment: Capacitor-0603-1uF-25V-X5R)
D3  D3V3F4U10LP-7  [U-DFN2510-10]
J14  B6B-PH-K  [B6B-PH-K]
J15  hole  [HOLE-3.40MM-M3-7MMEYELET-MountingFeature]  (value not drawn)  (no BOM)
J16  hole  [HOLE-3.40MM-M3-7MMEYELET-MountingFeature]  (value not drawn)  (no BOM)
J17  hole  [HOLE-3.40MM-M3-7MMEYELET-MountingFeature]  (value not drawn)  (no BOM)
J18  hole  [HOLE-3.40MM-M3-7MMEYELET-MountingFeature]  (value not drawn)  (no BOM)
P10  5pos-SMD-1.27mm  [HDR1X5-SMD-50mils-SILK]
R21  value 1.69k  [Resistor-0603]  (hidden comment: SMT resistor)
R22  value 3.3k  [Resistor-0603]  (hidden comment: SMT resistor)
R23  value 4.7k  [Resistor-0603]  (hidden comment: SMT resistor)
R24  value 4.7k  [Resistor-0603]  (hidden comment: SMT resistor)
R25  value 4.7k  [Resistor-0603]  (hidden comment: SMT resistor)
R26  value 1.69k  [Resistor-0603]  (hidden comment: SMT resistor)
R27  value 3.3k  [Resistor-0603]  (hidden comment: SMT resistor)
R28  value 1.69k  [Resistor-0603]  (hidden comment: SMT resistor)
R29  value 3.3k  [Resistor-0603]  (hidden comment: SMT resistor)
T4  NetTie_0402  [NetTie-0402]  (value not drawn)
T5  NetTie_0402  [NetTie-0402]  (value not drawn)
U10  LM358QT  [DFN8-2x2]  (parts A,B of 2)
U11  LM358QT  [DFN8-2x2]  (part A of 2)
U12  AS5600-ASOM  [AS5600L-ASOM_AMS]

### Nets
3V3: C66.2 T4.1 U12.1(VDD5V) U12.2(VDD3V3)
5V: J14.1 P10.1 R23.2 R24.2 R25.2 U10.8(VS+) U11.8(VS+)
GND: C66.1 D3.3(L3) D3.8(L4) J14.4 J15.1 J16.1 J17.1 J18.1 P10.5 R22.1 R27.1 R29.1 T5.2 U10.4(VS-) U11.4(VS-) U12.4(GND)
AS6500-OUT: U12.3(OUT)
hall_P1: R21.2 R22.2
hall_P2: R26.2 R27.2
hall_P3: R28.2 R29.2
SCL: U12.7(SCL)
SDA: U12.6(SDA)
SPI_CS1: D3.1(L2) J14.6
SPI_MISO: D3.2(GND) J14.5
SPI_MOSI: D3.4(L4) J14.3
SPI_SCK: D3.5(VDD) J14.2
NetP10_2: P10.2 R23.1 U10.3(IN1+)
NetP10_3: P10.3 R24.1 U10.5(IN2+)
NetP10_4: P10.4 R25.1 U11.3(IN1+)
NetR21_1: R21.1 U10.1(OUT1) U10.2(IN1-)
NetR26_1: R26.1 U10.6(IN2-) U10.7(OUT2)
NetR28_1: R28.1 U11.1(OUT1) U11.2(IN1-)
NetT4_2: T4.2 T5.1 U12.8(DIR)

Not connected (* = marked no-connect by the designer): U12 5(PGO)*

### Notes on the sheet
- Title:
- Date:
- Size:
- B
- Drawn by:
- Checked by:
- Sheet
- of
- Revision:
- File:
- (in symbol LM358QT, part A) V+; +; _; V-
- (in symbol LM358QT, part B) V+; +; _; V-
- (in symbol NetTie_0402) 0402

### Library data of the parts
C66 = Capacitor-0603-1uF-25V-X5R: Precision: X5R-10%; Package / Case: Metric 1608, EIA 0603; Mounted: Yes; Supplier 1: Digi-Key; Supplier Part Number 1: 1276-1859-2-ND; Supplier 2: Digi-Key; Supplier Part Number 2: 1276-1942-2-ND
D3 = D3V3F4U10LP-7: 5V (Typ) Clamp 5A (8/20µs) Ipp Tvs Diode Surface Mount U-DFN2510-10; Supplier 1: Digi-Key; Supplier Part Number 1: D3V3F4U10LP-7DICT-ND; Mounted: Yes; Package / Case: SOT23-6; Volt: 5V
J14 = B6B-PH-K: JST, TH, 6 position 0.079" (2.00mm); Price: None; Value: *; Package: None; Availability: Unavailable; MP: B6B-PH-K; Supplier 1: Digikey; Supplier Part Number 1: 455-B6B-PH-K-ND; HelpURL: https://www.jst-mfg.com/product/pdf/eng/ePH.pdf
J15-J18 = Hole 3.40mm M3-MountingFeature: Hole for M3 Bolt with 7mm pad; Mounted: N/A
R21 R26 R28 = Resistor-0603-1.69k: Resistor0603-1.69k; Precision: 1%; Watt: 0.25W; Mounted: Yes; Package / Case: Metric 1608, EIA 0603; Supplier 1: Digi-Key; Supplier Part Number 1: 311-1.69KHRCT-ND
R22 R27 R29 = Resistor-0603-3.3k: Resistor0603-3.3k; Precision: 5%; Watt: 0.25W; Mounted: Yes; Package / Case: Metric 1608, EIA 0603; Supplier 1: Digi-Key; Supplier Part Number 1: 311-3.30KHRCT-ND
R23-R25 = Resistor-0603-4.7k: Resistor0603-4.7k; Precision: 1%; Watt: 0.1W; Mounted: Yes; Package / Case: Metric 1608, EIA 0603; Supplier 1: Digi-Key; Supplier Part Number 1: 13-RC0603FR-134K7LCT-ND
U10 U11 = LM358QT: General Purpose Amplifier 2 Circuit 8-DFN (2x2); Package / Case: 8-DFN (2x2); Mounted: Yes; Supplier 1: Digikey; Supplier Part Number 1: 497-12007-1-ND; helpURL: https://www.st.com/content/ccc/resource/technical/document/datasheet/61/46/87/01/98/ed/44/c5/CD00000464.pdf/files/CD00000464.pdf/jcr:content/translations/en.CD00000464.pdf
U12 = AS5600-ASOM: SENSOR ANGLE 360DEG SMD; Mfr_Name: ams OSRAM; Manufacturer_Part_Number: AS5600L-ASOM; Copyright: Copyright (C) 2023 Ultra Librarian. All rights reserved.; RefDes: RefDes; Type: DEV
P10 = 5pos-SMD-1.27mm: Supplier 1: Digi-Key; Supplier Part Number 1: N/A; Mounted: Yes; Package / Case: TH; Volt: N/A

## Nets that join several sheets
3V3: ESP32 (18 pins), Power (8 pins), MotorDriver (6 pins), Sensors (C66.2 T4.1 U12.1 U12.2)
5V: ESP32 (D1.5 P1.A4B9 P1.B4A9), Power (11 pins), Sensors (7 pins)
24V: Power (5 pins), MotorDriver (11 pins)
GND: ESP32 (27 pins), Power (17 pins), MotorDriver (29 pins), Sensors (16 pins)
AS6500-OUT: ESP32 (U1.11), Sensors (U12.3)
CAN_H: ESP32 (D2.2 U2.7), Power (P9.2)
CAN_L: ESP32 (D2.1 U2.6), Power (P9.1)
current_P1: ESP32 (U1.18), MotorDriver (U7.5)
current_P3: ESP32 (U1.19), MotorDriver (U9.5)
hall_P1: ESP32 (U1.27), Sensors (R21.2 R22.2)
hall_P2: ESP32 (U1.24), Sensors (R26.2 R27.2)
hall_P3: ESP32 (U1.23), Sensors (R28.2 R29.2)
IN_P1: ESP32 (U1.16), MotorDriver (R7.1)
IN_P2: ESP32 (U1.14), MotorDriver (R9.1)
IN_P3: ESP32 (U1.12), MotorDriver (R16.1)
INH_P1: ESP32 (U1.17), MotorDriver (R10.1)
INH_P2: ESP32 (U1.15), MotorDriver (R11.1)
INH_P3: ESP32 (U1.13), MotorDriver (R18.1)
SCL: ESP32 (U1.9), Sensors (U12.7)
SDA: ESP32 (U1.10), Sensors (U12.6)
SPI_CS1: ESP32 (U1.38), Sensors (D3.1 J14.6)
SPI_MISO: ESP32 (U1.39), Sensors (D3.2 J14.5)
SPI_MOSI: ESP32 (U1.40), Sensors (D3.4 J14.3)
SPI_SCK: ESP32 (U1.41), Sensors (D3.5 J14.2)